# EAGLE design 8k (EAGLE 9.6.0)
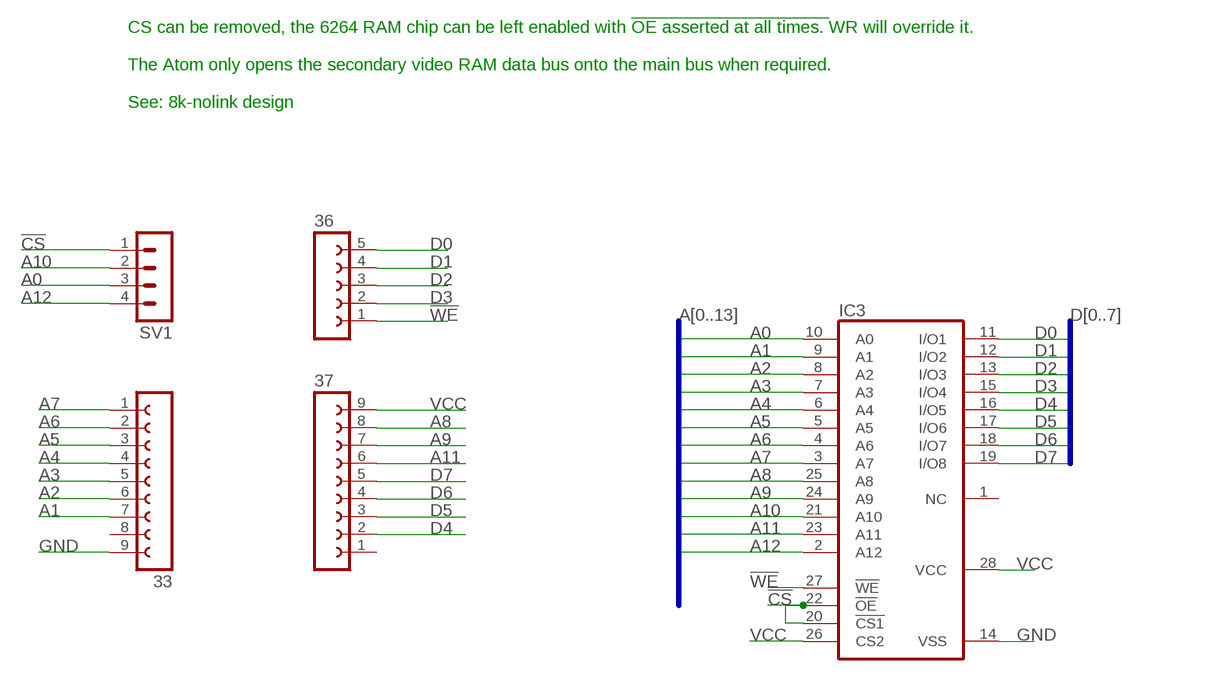
[diagram p0: schematic, sheet 1]

## Parts
33  FE09-1  [FE09]
36  FE05-1  [FE05-1]
37  FE09-1  [FE09]
IC3  6264A  [DIL28-6]
SV1  MA04-1  [MA04-1]

## Nets
!CS: IC3.20(!CS1) IC3.22(!OE) SV1.1
!WE: 36.1 IC3.27(!WE)
A0: IC3.10(A0) SV1.3
A1: 33.7 IC3.9(A1)
A2: 33.6 IC3.8(A2)
A3: 33.5 IC3.7(A3)
A4: 33.4 IC3.6(A4)
A5: 33.3 IC3.5(A5)
A6: 33.2 IC3.4(A6)
A7: 33.1 IC3.3(A7)
A8: 37.8 IC3.25(A8)
A9: 37.7 IC3.24(A9)
A10: IC3.21(A10) SV1.2
A11: 37.6 IC3.23(A11)
A12: IC3.2(A12) SV1.4
D0: 36.5 IC3.11(I/O1)
D1: 36.4 IC3.12(I/O2)
D2: 36.3 IC3.13(I/O3)
D3: 36.2 IC3.15(I/O4)
D4: 37.2 IC3.16(I/O5)
D5: 37.3 IC3.17(I/O6)
D6: 37.4 IC3.18(I/O7)
D7: 37.5 IC3.19(I/O8)
GND: 33.9 IC3.14(VSS)
VCC: 37.9 IC3.26(CS2) IC3.28(VCC)
Unconnected: 33.8 37.1 IC3.1(NC)

## Buses
A[0..13]
D[0..7]

## Notes on the sheet
- CS can be removed, the 6264 RAM chip can be left enabled with !OE asserted at all times. !WR will override it. 
  
  The Atom only opens the secondary video RAM data bus onto the main bus when required.
  
  See: 8k-nolink design

## Library data of the parts
33 37 = con-lsta:FE09-1: FEMALE HEADER; OC_FARNELL: unknown; OC_NEWARK: unknown
36 = con-lsta:FE05-1: FEMALE HEADER; OC_FARNELL: unknown; OC_NEWARK: unknown
IC3 = memory-hitachi:6264A: MEMORY; OC_FARNELL: 283605; OC_NEWARK: unknown
SV1 = con-lstb:MA04-1: PIN HEADER; OC_FARNELL: unknown; OC_NEWARK: unknown

## Board
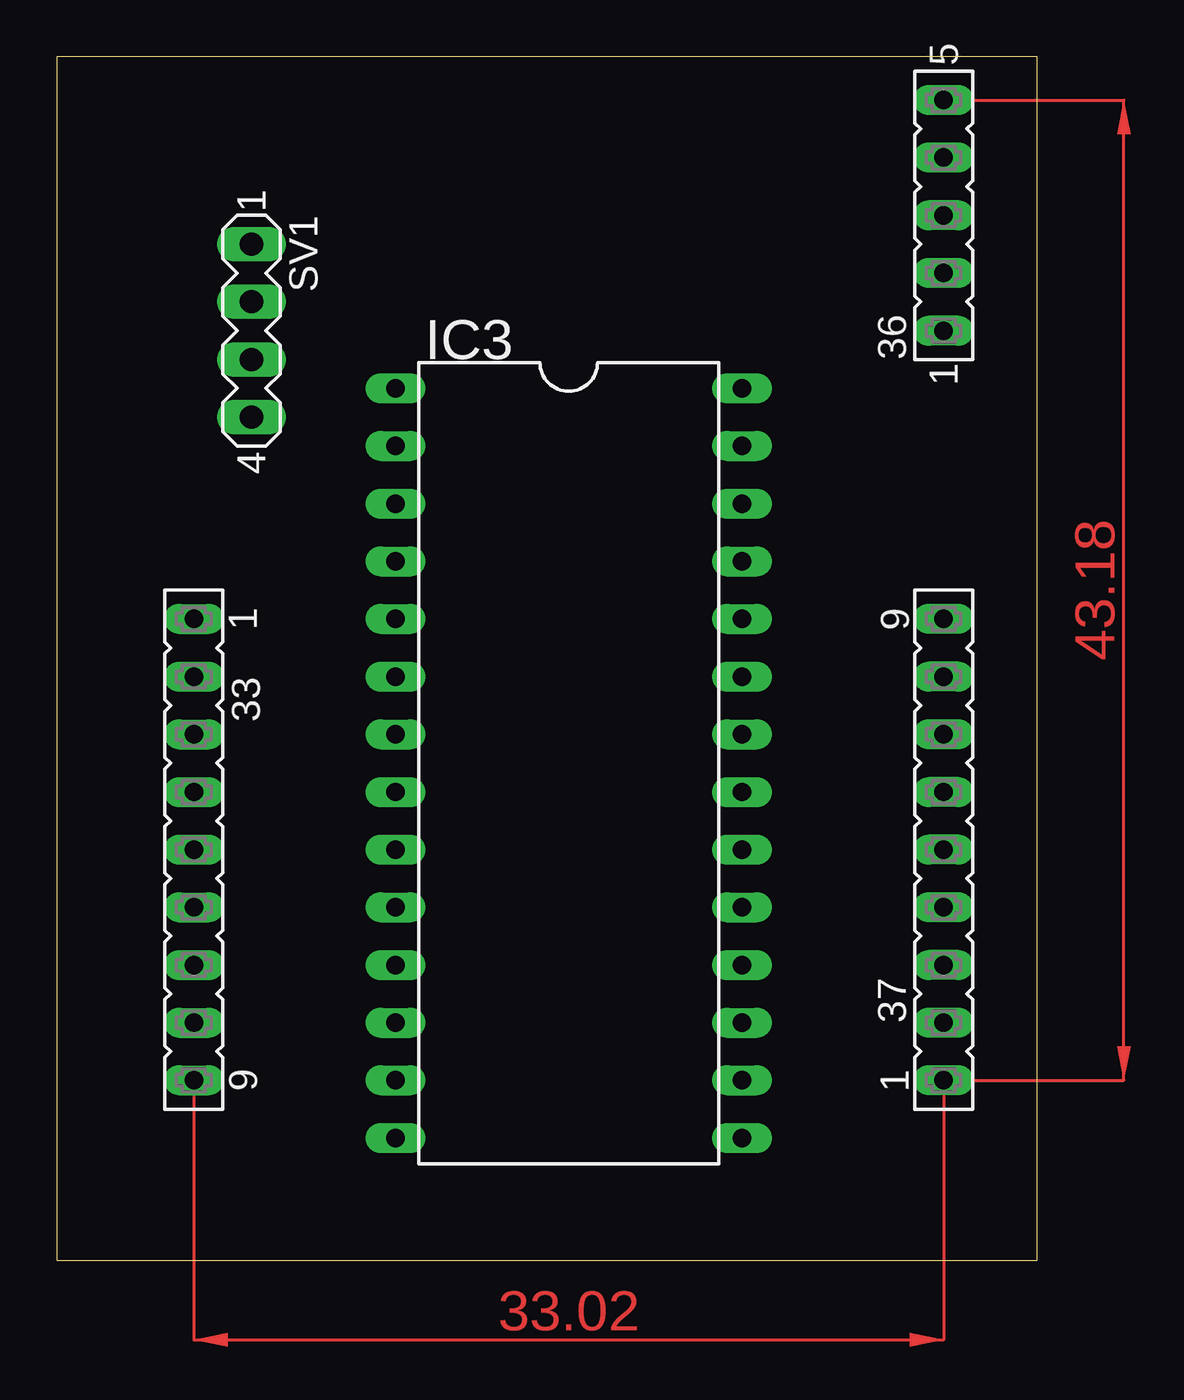
[diagram p1: board, top side]
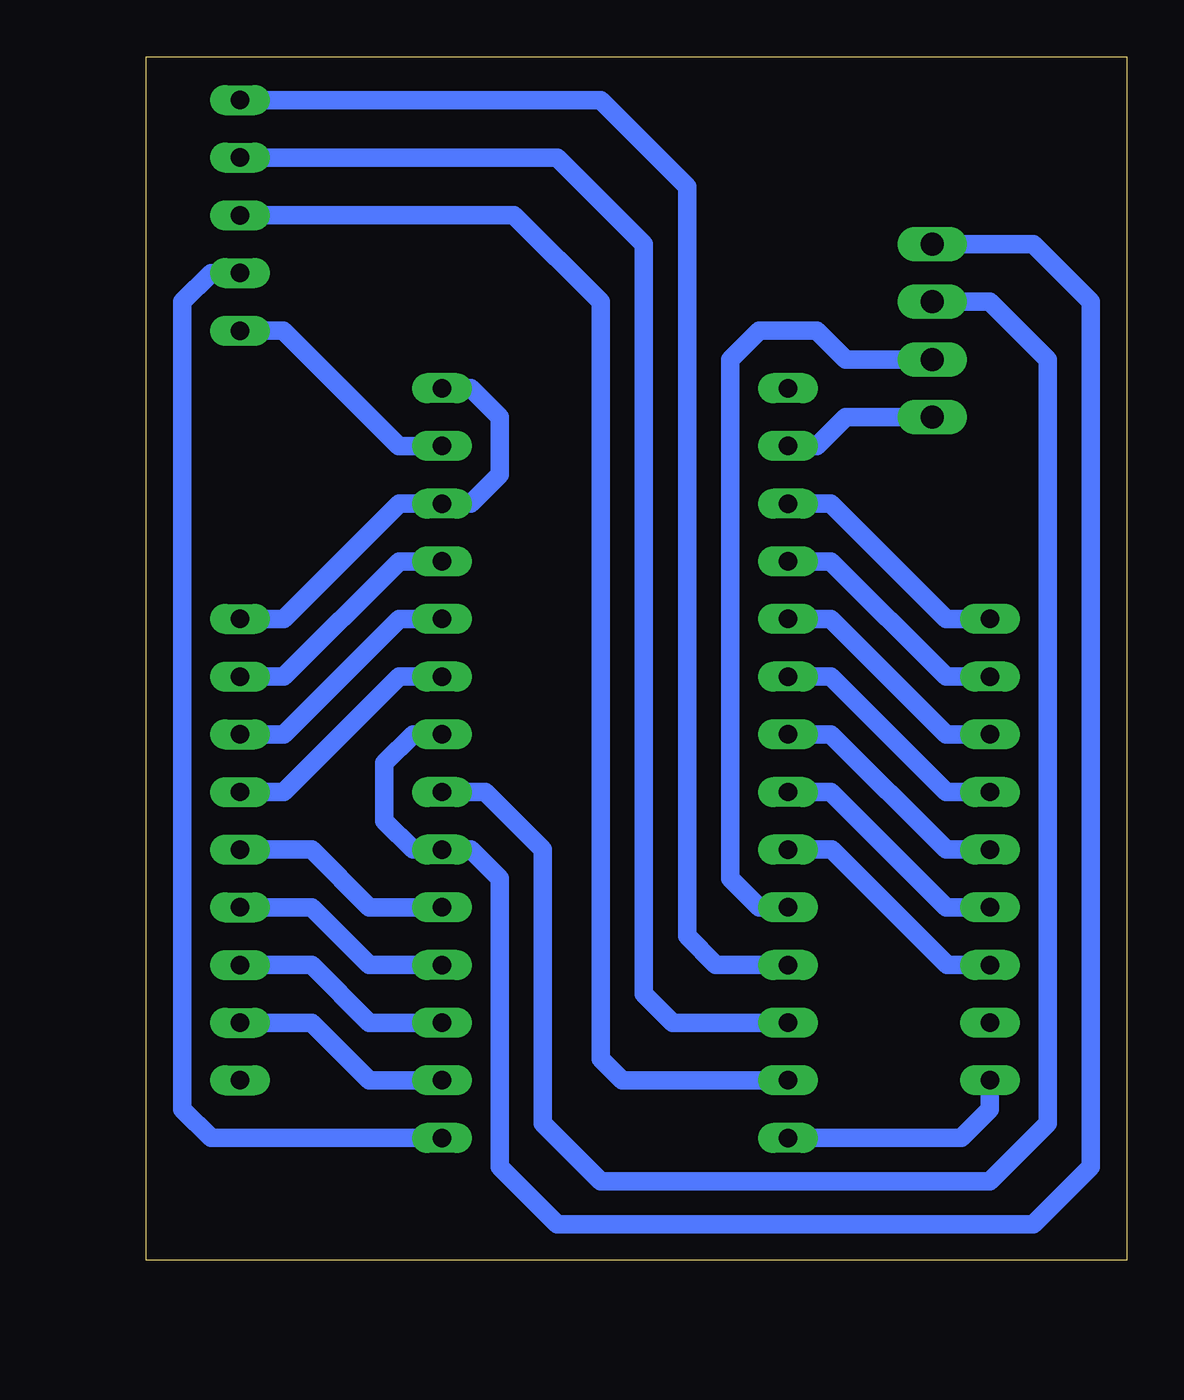
[diagram p2: board, bottom side, seen from below]

Size 43.18 x 53.02 mm. Coordinates in mm from the lower left corner, seen from the top.
Outline: 0,53.02 0,0 43.18,0 43.18,53.02 0,53.02
Copper layers (1*16): Top 0.035mm / dielectric 1.5mm / Bottom 0.035mm
Design rules "default": minimum track width 6mil, minimum drill 0.35mm, track to track 6mil, track to pad 6mil, pad to pad 6mil, via to via 6mil, smd to smd 6mil, copper to edge 40mil, drill to drill 6mil, minimum pad ring 10mil, minimum via ring 8mil, stop-mask expansion 4mil, vias tented up to drill 0mil, thermal gap 10mil

### Footprints (pad centres in the part's own frame; a part is rotated, then mirrored left to right if it is on the bottom)
FE09 = drill 0.813 long: 1 -10.16,0; 2 -7.62,0; 3 -5.08,0; 4 -2.54,0; 5 0,0; 6 2.54,0; 7 5.08,0; 8 7.62,0; 9 10.16,0
FE05-1 = drill 0.813 long: 1 -5.08,0; 2 -2.54,0; 3 0,0; 4 2.54,0; 5 5.08,0
DIL28-6 = drill 0.813 long: 1 -16.51,-7.62; 2 -13.97,-7.62; 3 -11.43,-7.62; 4 -8.89,-7.62; 5 -6.35,-7.62; 6 -3.81,-7.62; 7 -1.27,-7.62; 8 1.27,-7.62; 9 3.81,-7.62; 10 6.35,-7.62; 11 8.89,-7.62; 12 11.43,-7.62; 13 13.97,-7.62; 14 16.51,-7.62; 15 16.51,7.62; 16 13.97,7.62; 17 11.43,7.62; 18 8.89,7.62; 19 6.35,7.62; 20 3.81,7.62; 21 1.27,7.62; 22 -1.27,7.62; 23 -3.81,7.62; 24 -6.35,7.62; 25 -8.89,7.62; 26 -11.43,7.62; 27 -13.97,7.62; 28 -16.51,7.62
MA04-1 = drill 1.016 long: 1 -3.81,0; 2 -1.27,0; 3 1.27,0; 4 3.81,0

### Placement (x,y rotation side)
33  6.03,18.1 270 top
36  39.05,46.04 90 top
37  39.05,18.1 90 top
IC3  22.54,21.91 270 top
SV1  8.57,40.96 270 top

### Tracks (layer width: path | path; a pad name or v marks a point on that pad's centre or on a via)
!CS
  Bottom 0.813: IC3.22 31.43,23.18 32.7,21.91 32.7,19.37 31.43,18.1 IC3.20 28.89,18.1 27.62,16.83 27.62,4.13 25.08,1.59 4.13,1.59 1.59,4.13 1.59,42.23 4.13,44.77 SV1.1
!WE
  Bottom 0.813: 36.1 37.15,40.96 32.07,35.88 IC3.27
A0
  Bottom 0.813: SV1.3 12.38,39.69 13.65,40.96 16.19,40.96 17.46,39.69 17.46,16.83 16.19,15.56 IC3.10
A1
  Bottom 0.813: IC3.9 12.99,18.1 7.91,13.02 33.7
A2
  Bottom 0.813: 33.6 7.96,15.56 13.04,20.64 IC3.8
A3
  Bottom 0.813: 33.5 7.96,18.1 13.04,23.18 IC3.7
A4
  Bottom 0.813: 33.4 7.96,20.64 13.04,25.72 IC3.6
A5
  Bottom 0.813: 33.3 7.96,23.18 13.04,28.26 IC3.5
A6
  Bottom 0.813: 33.2 7.96,25.72 13.04,30.8 IC3.4
A7
  Bottom 0.813: 33.1 7.96,28.26 13.04,33.34 IC3.3
A8
  Bottom 0.813: 37.8 37.12,25.72 32.04,30.8 IC3.25
A9
  Bottom 0.813: 37.7 37.12,23.18 32.04,28.26 IC3.24
A10
  Bottom 0.813: IC3.21 28.26,20.64 25.72,18.1 25.72,6.03 23.18,3.49 6.03,3.49 3.49,6.03 3.49,39.69 6.03,42.23 SV1.2
A11
  Bottom 0.813: 37.6 37.12,20.64 32.04,25.72 IC3.23
A12
  Bottom 0.813: IC3.2 13.65,35.88 12.38,37.15 SV1.4
D0
  Bottom 0.813: 36.5 23.18,51.12 19.37,47.31 19.37,14.29 18.1,13.02 IC3.11
D1
  Bottom 0.813: 36.4 25.08,48.58 21.27,44.77 21.27,11.75 20,10.48 IC3.12
D2
  Bottom 0.813: 36.3 26.99,46.04 23.18,42.23 23.18,8.89 22.23,7.94 IC3.13
D3
  Bottom 0.813: IC3.15 40.32,5.4 41.59,6.67 41.59,42.23 40.32,43.5 36.2
D4
  Bottom 0.813: IC3.16 33.36,7.94 35.9,10.48 37.2
D5
  Bottom 0.813: IC3.17 33.36,10.48 35.9,13.02 37.3
D6
  Bottom 0.813: IC3.18 33.36,13.02 35.9,15.56 37.4
D7
  Bottom 0.813: IC3.19 33.36,15.56 35.9,18.1 37.5
GND
  Bottom 0.813: IC3.14 7.3,5.4 6.03,6.67 33.9
VCC
  Bottom 0.813: IC3.28 28.89,38.42 27.62,37.15 27.62,34.61 28.89,33.34 IC3.26 32.04,33.34 37.12,28.26 37.9
(copper drawn outside any net)
  shapes: Top area x2